# Altium project STM32F407ZGT6_CoreBoard.PrjPcb
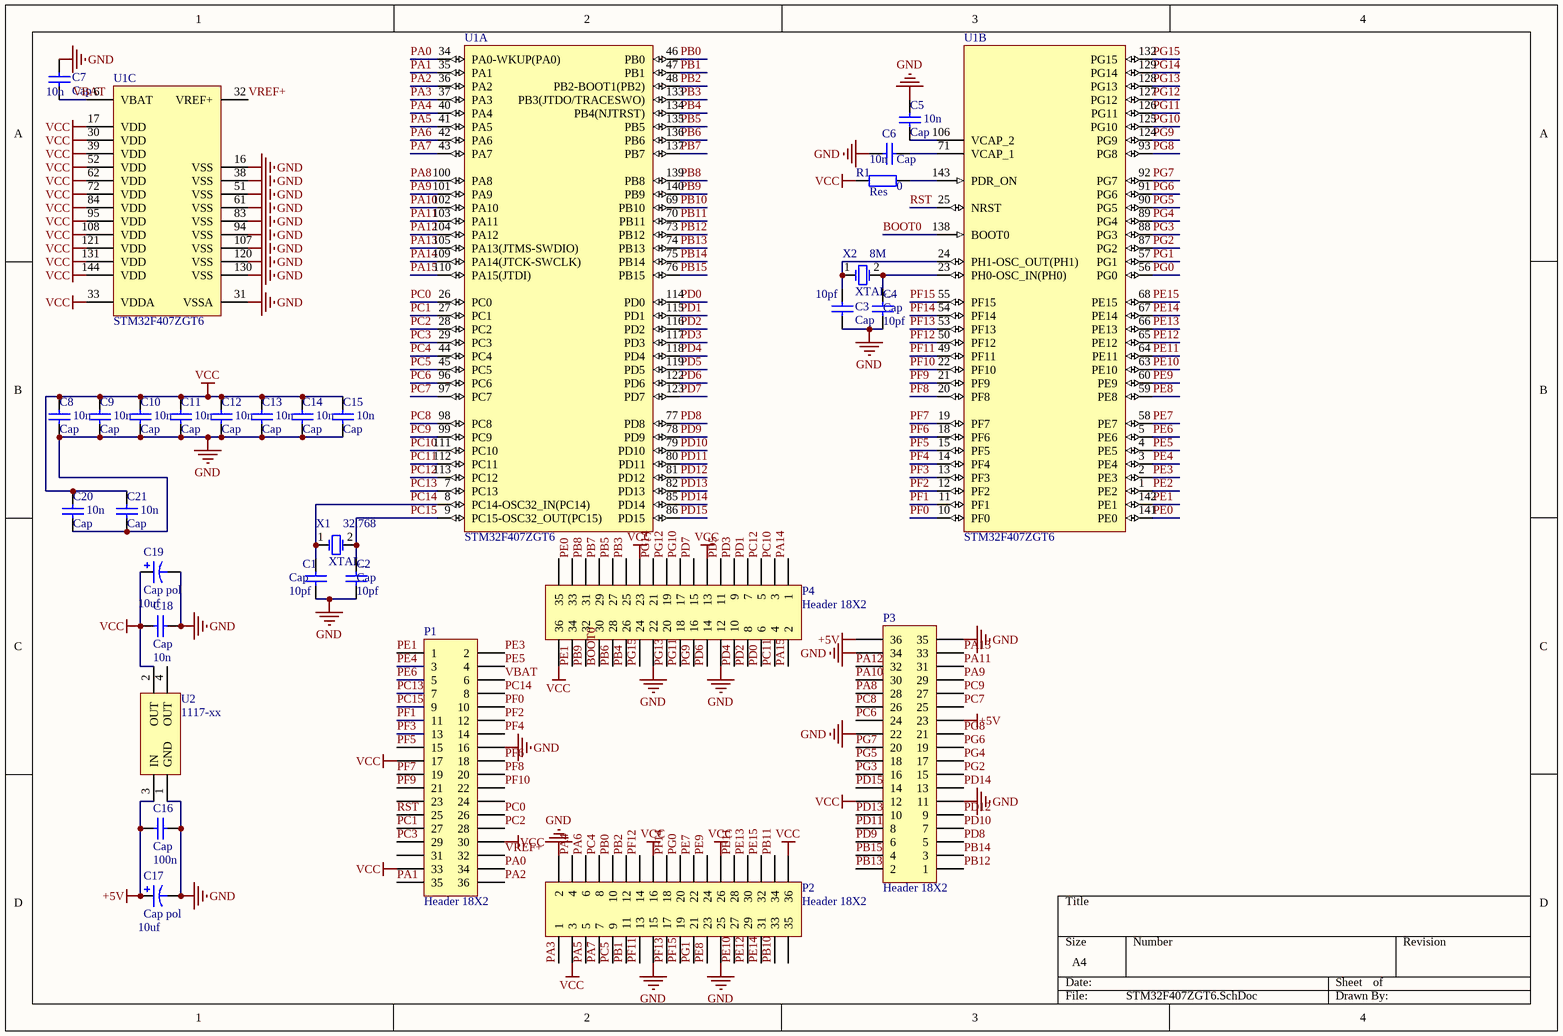
[diagram p0: STM32F407ZGT6.SchDoc]
1 sheet, 30 parts. Net scope: global (net labels, ports and power ports of the same name join across sheets).
Board file: PCB1.PcbDoc

## Sheet STM32F407ZGT6.SchDoc
size A4

### Parts
C1  Cap  value 10pf  [0805C]
C2  Cap  value 10pf  [0805C]
C3  Cap  value 10pf  [0805C]
C4  Cap  value 10pf  [0805C]
C5  Cap  value 10n  [0805C]
C6  Cap  value 10n  [0805C]
C7  Cap  value 10n  [0805C]
C8  Cap  value 10n  [0805C]
C9  Cap  value 10n  [0805C]
C10  Cap  value 10n  [0805C]
C11  Cap  value 10n  [0805C]
C12  Cap  value 10n  [0805C]
C13  Cap  value 10n  [0805C]
C14  Cap  value 10n  [0805C]
C15  Cap  value 10n  [0805C]
C16  Cap  value 100n  [0805C]
C17  Cap pol  value 10uf  [CAP_SMD_3216]
C18  Cap  value 10n  [0805C]
C19  Cap pol  value 10uf  [CAP_SMD_3216]
C20  Cap  value 10n  [0805C]
C21  Cap  value 10n  [0805C]
P1  Header 18X2  [HDR2X18]
P2  Header 18X2  [HDR2X18]
P3  Header 18X2  [HDR2X18]
P4  Header 18X2  [HDR2X18]
R1  Res  value 0  [0805R]
U1  STM32F407ZGT6  [STM-LQFP144_N]  (parts A,B,C of 3)
U2  1117-xx  [SOT-223_]
X1  XTAL_  value 32.768  [XTAL_YUANZHU]
X2  XTAL_  value 8M  [XTAL]

### Nets
+5V: C16.2 C17.1 P3.23 P3.36 U2.3(IN)
GND: C1.1 C2.1 C3.1 C4.1 C5.2 C6.1 C7.1 C8.1 C9.1 C10.1 C11.1 C12.1 C13.1 C14.1 C15.1 C16.1 C17.2 C18.1 C19.2 C20.1 C21.1 P1.16 P2.2 P2.15 P2.25 P3.11 P3.22 P3.34 P3.35 P4.12 P4.22 U1.16(VSS) U1.31(VSSA) U1.38(VSS) U1.51(VSS) U1.61(VSS) U1.83(VSS) U1.94(VSS) U1.107(VSS) U1.120(VSS) U1.130(VSS) U2.1(GND)
VCC: C8.2 C9.2 C10.2 C11.2 C12.2 C13.2 C14.2 C15.2 C18.2 C19.1 C20.2 C21.2 P1.17 P1.30 P1.33 P2.3 P2.16 P2.26 P2.36 P3.12 P4.13 P4.23 P4.36 R1.1 U1.17(VDD) U1.30(VDD) U1.33(VDDA) U1.39(VDD) U1.52(VDD) U1.62(VDD) U1.72(VDD) U1.84(VDD) U1.95(VDD) U1.108(VDD) U1.121(VDD) U1.131(VDD) U1.144(VDD) U2.2(OUT)
BOOT0: P4.30 U1.138(BOOT0)
PA0: P1.34 U1.34(PA0-WKUP(PA0))
PA1: P1.35 U1.35(PA1)
PA2: P1.36 U1.36(PA2)
PA3: P2.1 U1.37(PA3)
PA4: P2.4 U1.40(PA4)
PA5: P2.5 U1.41(PA5)
PA6: P2.6 U1.42(PA6)
PA7: P2.7 U1.43(PA7)
PA8: P3.28 U1.100(PA8)
PA9: P3.29 U1.101(PA9)
PA10: P3.30 U1.102(PA10)
PA11: P3.31 U1.103(PA11)
PA12: P3.32 U1.104(PA12)
PA13: P3.33 U1.105(PA13(JTMS-SWDIO))
PA14: P4.1 U1.109(PA14(JTCK-SWCLK))
PA15: P4.2 U1.110(PA15(JTDI))
PB0: P2.10 U1.46(PB0)
PB1: P2.11 U1.47(PB1)
PB2: P2.12 U1.48(PB2-BOOT1(PB2))
PB3: P4.25 U1.133(PB3(JTDO/TRACESWO))
PB4: P4.26 U1.134(PB4(NJTRST))
PB5: P4.27 U1.135(PB5)
PB6: P4.28 U1.136(PB6)
PB7: P4.29 U1.137(PB7)
PB8: P4.31 U1.139(PB8)
PB9: P4.32 U1.140(PB9)
PB10: P2.33 U1.69(PB10)
PB11: P2.34 U1.70(PB11)
PB12: P3.1 U1.73(PB12)
PB13: P3.2 U1.74(PB13)
PB14: P3.3 U1.75(PB14)
PB15: P3.4 U1.76(PB15)
PC0: P1.26 U1.26(PC0)
PC1: P1.27 U1.27(PC1)
PC2: P1.28 U1.28(PC2)
PC3: P1.29 U1.29(PC3)
PC4: P2.8 U1.44(PC4)
PC5: P2.9 U1.45(PC5)
PC6: P3.24 U1.96(PC6)
PC7: P3.25 U1.97(PC7)
PC8: P3.26 U1.98(PC8)
PC9: P3.27 U1.99(PC9)
PC10: P4.3 U1.111(PC10)
PC11: P4.4 U1.112(PC11)
PC12: P4.5 U1.113(PC12)
PC13: P1.7 U1.7(PC13)
PC14: C1.2 P1.8 U1.8(PC14-OSC32_IN(PC14)) X1.1(OSC1)
PC15: C2.2 P1.9 U1.9(PC15-OSC32_OUT(PC15)) X1.2(OSC2)
PD0: P4.6 U1.114(PD0)
PD1: P4.7 U1.115(PD1)
PD2: P4.8 U1.116(PD2)
PD3: P4.9 U1.117(PD3)
PD4: P4.10 U1.118(PD4)
PD5: P4.11 U1.119(PD5)
PD6: P4.14 U1.122(PD6)
PD7: P4.15 U1.123(PD7)
PD8: P3.5 U1.77(PD8)
PD9: P3.6 U1.78(PD9)
PD10: P3.7 U1.79(PD10)
PD11: P3.8 U1.80(PD11)
PD12: P3.9 U1.81(PD12)
PD13: P3.10 U1.82(PD13)
PD14: P3.13 U1.85(PD14)
PD15: P3.14 U1.86(PD15)
PE0: P4.33 U1.141(PE0)
PE1: P1.1 P4.34 U1.142(PE1)
PE2: U1.1(PE2)
PE3: P1.2 U1.2(PE3)
PE4: P1.3 U1.3(PE4)
PE5: P1.4 U1.4(PE5)
PE6: P1.5 U1.5(PE6)
PE7: P2.22 U1.58(PE7)
PE8: P2.23 U1.59(PE8)
PE9: P2.24 U1.60(PE9)
PE10: P2.27 U1.63(PE10)
PE11: P2.28 U1.64(PE11)
PE12: P2.29 U1.65(PE12)
PE13: P2.30 U1.66(PE13)
PE14: P2.31 U1.67(PE14)
PE15: P2.32 U1.68(PE15)
PF0: P1.10 U1.10(PF0)
PF1: P1.11 U1.11(PF1)
PF2: P1.12 U1.12(PF2)
PF3: P1.13 U1.13(PF3)
PF4: P1.14 U1.14(PF4)
PF5: P1.15 U1.15(PF5)
PF6: P1.18 U1.18(PF6)
PF7: P1.19 U1.19(PF7)
PF8: P1.20 U1.20(PF8)
PF9: P1.21 U1.21(PF9)
PF10: P1.22 U1.22(PF10)
PF11: P2.13 U1.49(PF11)
PF12: P2.14 U1.50(PF12)
PF13: P2.17 U1.53(PF13)
PF14: P2.18 U1.54(PF14)
PF15: P2.19 U1.55(PF15)
PG0: P2.20 U1.56(PG0)
PG1: P2.21 U1.57(PG1)
PG2: P3.15 U1.87(PG2)
PG3: P3.16 U1.88(PG3)
PG4: P3.17 U1.89(PG4)
PG5: P3.18 U1.90(PG5)
PG6: P3.19 U1.91(PG6)
PG7: P3.20 U1.92(PG7)
PG8: P3.21 U1.93(PG8)
PG9: P4.16 U1.124(PG9)
PG10: P4.17 U1.125(PG10)
PG11: P4.18 U1.126(PG11)
PG12: P4.19 U1.127(PG12)
PG13: P4.20 U1.128(PG13)
PG14: P4.21 U1.129(PG14)
PG15: P4.24 U1.132(PG15)
RST: P1.25 U1.25(NRST)
VBAT: C7.2 P1.6 U1.6(VBAT)
VREF+: P1.32 U1.32(VREF+)
NetC3_2: C3.2 U1.24(PH1-OSC_OUT(PH1)) X2.1(OSC1)
NetC4_2: C4.2 U1.23(PH0-OSC_IN(PH0)) X2.2(OSC2)
NetC5_1: C5.1 U1.106(VCAP_2)
NetC6_2: C6.2 U1.71(VCAP_1)
NetR1_2: R1.2 U1.143(PDR_ON)

Not connected (* = marked no-connect by the designer): P1 23 24 31; P2 35; P4 35; U2 4(OUT)

### Library data of the parts
C1-C16 C18 C20 C21 = Cap: 无极性电容
C17 C19 = Cap pol: 极性电容
P1-P4 = Header 18X2: Header, 18-Pin, Dual row; LatestRevisionDate: 17-Jul-2002; LatestRevisionNote: Re-released for DXP Platform.; Publisher: Altium Limited
R1 = Res_: 电阻
U1 = STM32F407ZGT6: ARM Cortex-M4 32-bit MCU+FPU, 210 DMIPS, 1024 kB Flash, 192 kB Internal RAM, 114 I/Os, 144-pin LQFP, -40 to 85 degC, Tray; Manufacturer: STMicroelectronics; D/A Converter: 2x12-bit; FLASH Size (Prog) (kB): 1024; I/Os (High Current): 114; Internal RAM Size (kB): 192; Operating Frequency(F) (Processor speed) (MHz): 168; Supply Voltage(Vcc) max (V): 3.6; Supply Voltage(Vcc) min (V): 1.8; DatasheetVersion: Rev. 4; PackageVersion: Rev. 4, 06/2013; PackageReference: LQFP144; PackageDescription: 144-Pin Low Profile Quad Flat Package, 20 x 20 mm Body, 0.5 mm Pitch; Supplier 1: Digi-Key; Supplier Part Number 1: 497-11766-ND; Supplier 2: Newark; Supplier Part Number 2: 73T2334; Supplier 3: Mouser; Supplier Part Number 3: 511-STM32F407ZGT6; Core: ARM Cortex-M4; Packing: Tray; Mounting Technology: Surface Mount; PartNumber: STM32F407ZGT6; ComponentLink1Description: Manufacturer URL; ComponentLink1URL: http://www.st.com/web/en/home.html; ComponentLink2Description: Datasheet; ComponentLink2URL: http://www.st.com/st-web-ui/static/active/en/resource/technical/document/datasheet/DM00037051.pdf; ComponentLink3Description: Package Specification; ComponentLink3URL: http://www.st.com/st-web-ui/static/active/en/resource/technical/document/datasheet/DM00037051.pdf
U2 = 1117-xx: 稳压芯片
X1 X2 = XTAL_M: 晶振